# EAGLE schematic LUZES_18Fv2 (EAGLE 5.06)
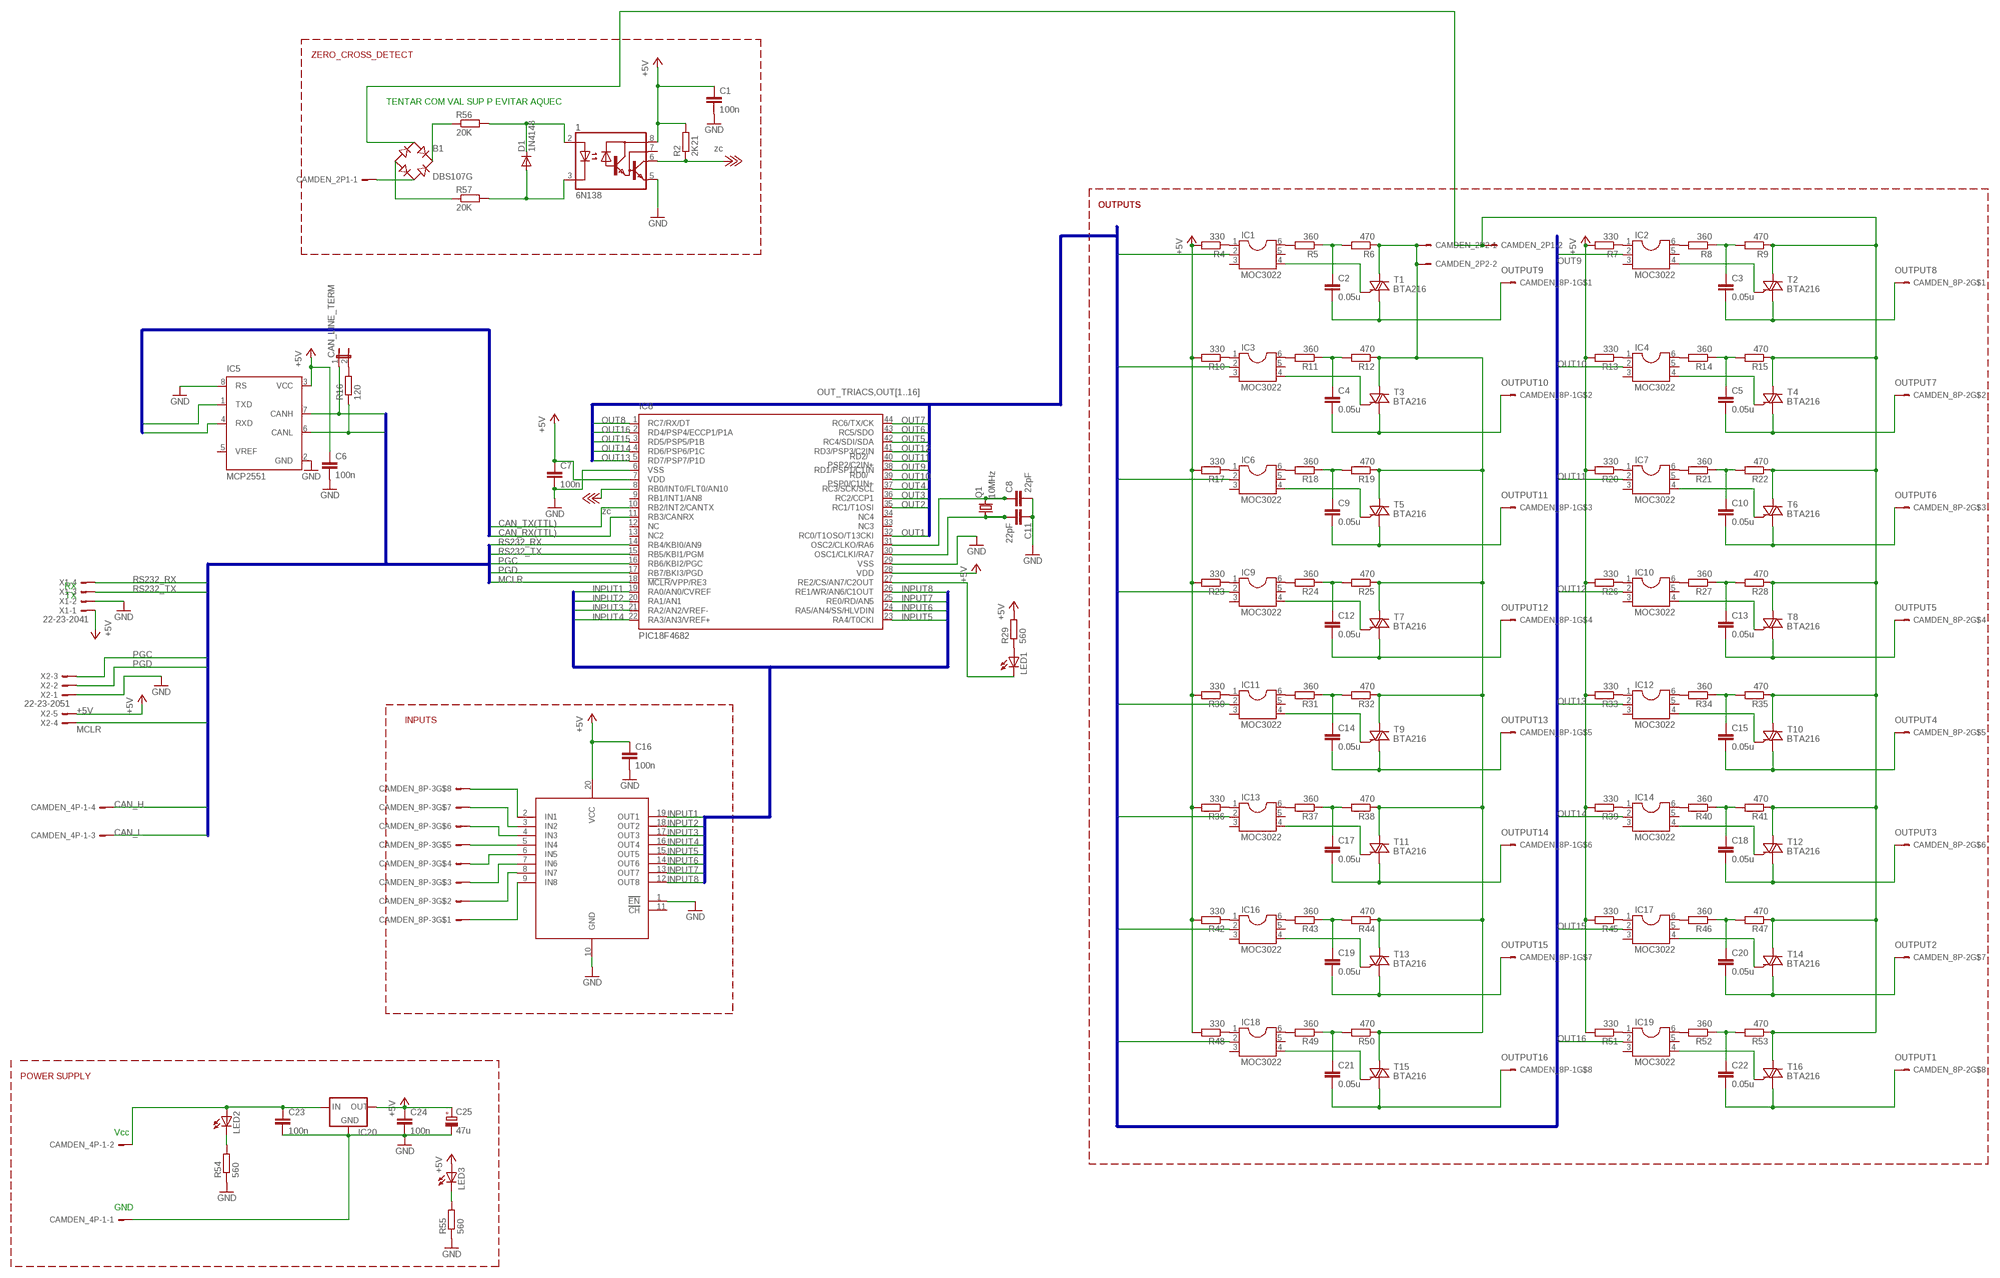
[diagram p0: schematic, sheet 1]

## Parts
1  6N138  [DIL08]
B1  DBS107G  [DBS]
C1  100n  C-EUC0805  [C0805]
C2  0.05u  C-EU050-025X075  [C050-025X075]
C3  0.05u  C-EU050-025X075  [C050-025X075]
C4  0.05u  C-EU050-025X075  [C050-025X075]
C5  0.05u  C-EU050-025X075  [C050-025X075]
C6  100n  C-EUC0805  [C0805]
C7  100n  C-EUC0805  [C0805]
C8  22pF  C-EUC0805  [C0805]
C9  0.05u  C-EU050-025X075  [C050-025X075]
C10  0.05u  C-EU050-025X075  [C050-025X075]
C11  22pF  C-EUC0805  [C0805]
C12  0.05u  C-EU050-025X075  [C050-025X075]
C13  0.05u  C-EU050-025X075  [C050-025X075]
C14  0.05u  C-EU050-025X075  [C050-025X075]
C15  0.05u  C-EU050-025X075  [C050-025X075]
C16  100n  C-EUC0805  [C0805]
C17  0.05u  C-EU050-025X075  [C050-025X075]
C18  0.05u  C-EU050-025X075  [C050-025X075]
C19  0.05u  C-EU050-025X075  [C050-025X075]
C20  0.05u  C-EU050-025X075  [C050-025X075]
C21  0.05u  C-EU050-025X075  [C050-025X075]
C22  0.05u  C-EU050-025X075  [C050-025X075]
C23  100n  C-EUC0805  [C0805]
C24  100n  C-EUC0805  [C0805]
C25  47u  CPOL-EUE2.5-5  [E2,5-5]
CAMDEN_2P1  CTB9550-2  [CTB9550-2]
CAMDEN_2P2  CTB9550-2  [CTB9550-2]
CAMDEN_4P-1  CTB9550-4  [CTB9550-4]
CAMDEN_8P-1  CTB9550-8  [CTB9550-8]
CAMDEN_8P-2  CTB9550-8  [CTB9550-8]
CAMDEN_8P-3  CTB9550-8  [CTB9550-8]
CAN_LINE_TERM  JP1E  [JP1]
D1  1N4148  [DO35-10]
IC1  MOC3022  DIL6  [DIL06]
IC2  MOC3022  DIL6  [DIL06]
IC3  MOC3022  DIL6  [DIL06]
IC4  MOC3022  DIL6  [DIL06]
IC5  MCP2551  PCA82C250  [DIL08]
IC6  MOC3022  DIL6  [DIL06]
IC7  MOC3022  DIL6  [DIL06]
IC8  PIC18F4682  PIC18F4682_85TQFP  [TQFP44]
IC9  MOC3022  DIL6  [DIL06]
IC10  MOC3022  DIL6  [DIL06]
IC11  MOC3022  DIL6  [DIL06]
IC12  MOC3022  DIL6  [DIL06]
IC13  MOC3022  DIL6  [DIL06]
IC14  MOC3022  DIL6  [DIL06]
IC15  MAX6818  MAX6818SSOP  [SSOP20]
IC16  MOC3022  DIL6  [DIL06]
IC17  MOC3022  DIL6  [DIL06]
IC18  MOC3022  DIL6  [DIL06]
IC19  MOC3022  DIL6  [DIL06]
IC20  78XXL  [78XXL]
LED1  LEDCHIP-LED0805  [CHIP-LED0805]
LED2  LEDCHIP-LED0805  [CHIP-LED0805]
LED3  LEDCHIP-LED0805  [CHIP-LED0805]
Q1  10MHz  CRYSTALHC49U-V  [HC49U-V]
R2  2K21  R-EU_M0805  [M0805]
R4  330  R-EU_M0805  [M0805]
R5  360  R-EU_R0805  [R0805]
R6  470  R-EU_R0805  [R0805]
R7  330  R-EU_M0805  [M0805]
R8  360  R-EU_R0805  [R0805]
R9  470  R-EU_R0805  [R0805]
R10  330  R-EU_M0805  [M0805]
R11  360  R-EU_R0805  [R0805]
R12  470  R-EU_R0805  [R0805]
R13  330  R-EU_M0805  [M0805]
R14  360  R-EU_R0805  [R0805]
R15  470  R-EU_R0805  [R0805]
R16  120  R-EU_M0805  [M0805]
R17  330  R-EU_M0805  [M0805]
R18  360  R-EU_R0805  [R0805]
R19  470  R-EU_R0805  [R0805]
R20  330  R-EU_M0805  [M0805]
R21  360  R-EU_R0805  [R0805]
R22  470  R-EU_R0805  [R0805]
R23  330  R-EU_M0805  [M0805]
R24  360  R-EU_R0805  [R0805]
R25  470  R-EU_R0805  [R0805]
R26  330  R-EU_M0805  [M0805]
R27  360  R-EU_R0805  [R0805]
R28  470  R-EU_R0805  [R0805]
R29  560  R-EU_R0805  [R0805]
R30  330  R-EU_M0805  [M0805]
R31  360  R-EU_R0805  [R0805]
R32  470  R-EU_R0805  [R0805]
R33  330  R-EU_M0805  [M0805]
R34  360  R-EU_R0805  [R0805]
R35  470  R-EU_R0805  [R0805]
R36  330  R-EU_M0805  [M0805]
R37  360  R-EU_R0805  [R0805]
R38  470  R-EU_R0805  [R0805]
R39  330  R-EU_M0805  [M0805]
R40  360  R-EU_R0805  [R0805]
R41  470  R-EU_R0805  [R0805]
R42  330  R-EU_M0805  [M0805]
R43  360  R-EU_R0805  [R0805]
R44  470  R-EU_R0805  [R0805]
R45  330  R-EU_M0805  [M0805]
R46  360  R-EU_R0805  [R0805]
R47  470  R-EU_R0805  [R0805]
R48  330  R-EU_M0805  [M0805]
R49  360  R-EU_R0805  [R0805]
R50  470  R-EU_R0805  [R0805]
R51  330  R-EU_M0805  [M0805]
R52  360  R-EU_R0805  [R0805]
R53  470  R-EU_R0805  [R0805]
R54  560  R-EU_R0805  [R0805]
R55  560  R-EU_R0805  [R0805]
R56  20K  R-EU_R2512  [R2512]
R57  20K  R-EU_R2512  [R2512]
T1  BTA216  TIC225S  [TO220DS]
T2  BTA216  TIC225S  [TO220DS]
T3  BTA216  TIC225S  [TO220DS]
T4  BTA216  TIC225S  [TO220DS]
T5  BTA216  TIC225S  [TO220DS]
T6  BTA216  TIC225S  [TO220DS]
T7  BTA216  TIC225S  [TO220DS]
T8  BTA216  TIC225S  [TO220DS]
T9  BTA216  TIC225S  [TO220DS]
T10  BTA216  TIC225S  [TO220DS]
T11  BTA216  TIC225S  [TO220DS]
T12  BTA216  TIC225S  [TO220DS]
T13  BTA216  TIC225S  [TO220DS]
T14  BTA216  TIC225S  [TO220DS]
T15  BTA216  TIC225S  [TO220DS]
T16  BTA216  TIC225S  [TO220DS]
X1  22-23-2041  [22-23-2041]
X2  22-23-2051  [22-23-2051]

## Nets
+5V: 1.8(VCC) C1.1 C6.1 C7.1 C16.1 C24.1 C25.+ IC5.3(VCC) IC8.7(VDD) IC8.28(VDD) IC15.20(VCC) IC20.OUT LED3.A R2.2 R4.2 R7.2 R10.2 R13.2 R17.2 R20.2 R23.2 R26.2 R29.2 R30.2 R33.2 R36.2 R39.2 R42.2 R45.2 R48.2 R51.2 X1.1 X2.5
+18V: 1.6(VO) IC8.8(RB0/INT0/FLT0/AN10) R2.1 ; supply symbol labelled zc
CAN_H: CAMDEN_4P-1.P$4 CAN_LINE_TERM.1 IC5.7(CANH)
CAN_L: CAMDEN_4P-1.P$3 IC5.6(CANL) R16.1
CAN_RX(TTL): IC5.4(RXD) IC8.11(RB3/CANRX)
CAN_TX(TTL): IC5.1(TXD) IC8.10(RB2/INT2/CANTX)
GND: 1.5(GND) C1.2 C6.2 C7.2 C8.2 C11.1 C16.2 C23.2 C24.2 C25.- CAMDEN_4P-1.P$1 IC5.2(GND) IC5.8(RS) IC8.6(VSS) IC8.29(VSS) IC15.1(EN) IC15.10(GND) IC20.GND R54.1 R55.1 X1.2 X2.1
INPUT1: IC8.19(RA0/AN0/CVREF) IC15.19(OUT1)
INPUT2: IC8.20(RA1/AN1) IC15.18(OUT2)
INPUT3: IC8.21(RA2/AN2/VREF-) IC15.17(OUT3)
INPUT4: IC8.22(RA3/AN3/VREF+) IC15.16(OUT4)
INPUT5: IC8.23(RA4/T0CKI) IC15.15(OUT5)
INPUT6: IC8.24(RA5/AN4/SS/HLVDIN) IC15.14(OUT6)
INPUT7: IC8.25(RE0/RD/AN5) IC15.13(OUT7)
INPUT8: IC8.26(RE1/WR/AN6/C1OUT) IC15.12(OUT8)
MCLR: IC8.18(!MCLR!/VPP/RE3) X2.4
N$1: C8.1 IC8.31(OSC2/CLKO/RA6) Q1.2
N$2: C11.2 IC8.30(OSC1/CLKI/RA7) Q1.1
N$3: B1.AC1 CAMDEN_2P1.P$2 R9.1 R15.1 R22.1 R28.1 R35.1 R41.1 R47.1 R53.1 T2.A2 T4.A2 T6.A2 T8.A2 T10.A2 T12.A2 T14.A2 T16.A2
N$4: B1.AC2 CAMDEN_2P1.P$1
N$5: B1.+ R56.1
N$6: CAMDEN_8P-3.P$16 IC15.2(IN1)
N$7: CAMDEN_8P-3.P$15 IC15.3(IN2)
N$8: CAMDEN_8P-3.P$9 IC15.9(IN8)
N$9: CAMDEN_8P-3.P$10 IC15.8(IN7)
N$10: CAMDEN_8P-3.P$11 IC15.7(IN6)
N$11: CAMDEN_8P-3.P$14 IC15.4(IN3)
N$12: CAMDEN_8P-3.P$13 IC15.5(IN4)
N$13: CAMDEN_8P-3.P$12 IC15.6(IN5)
N$16: IC3.6 R11.2
N$17: IC6.6 R18.2
N$18: IC9.6 R24.2
N$20: IC2.6 R8.2
N$25: IC4.6 R14.2
N$27: IC11.6 R31.2
N$29: IC13.6 R37.2
N$30: IC16.6 R43.2
N$33: IC17.6 R46.2
N$34: IC14.6 R40.2
N$35: IC12.6 R34.2
N$36: IC10.6 R27.2
N$37: IC7.6 R21.2
N$38: LED1.A R29.1
N$39: IC8.27(RE2/CS/AN7/C2OUT) LED1.C
N$40: IC18.6 R49.2
N$41: IC19.6 R52.2
N$46: CAMDEN_2P2.P$1 CAMDEN_2P2.P$2 R6.1 R12.1 R19.1 R25.1 R32.1 R38.1 R44.1 R50.1 T1.A2 T3.A2 T5.A2 T7.A2 T9.A2 T11.A2 T13.A2 T15.A2
N$111: C23.1 CAMDEN_4P-1.P$2 IC20.IN LED2.A
N$112: LED2.C R54.2
N$115: LED3.C R55.2
N$116: 1.2(A) D1.C R56.2
N$117: B1.- R57.1
N$118: 1.3(C) D1.A R57.2
N$119: IC1.1 R4.1
N$120: IC1.6 R5.2
N$121: C2.1 R5.1 R6.2
N$123: IC1.4 T1.G
N$125: IC3.1 R10.1
N$127: C4.1 R11.1 R12.2
N$129: IC3.4 T3.G
N$131: IC6.1 R17.1
N$133: C9.1 R18.1 R19.2
N$135: IC6.4 T5.G
N$137: IC9.1 R23.1
N$139: C12.1 R24.1 R25.2
N$141: IC9.4 T7.G
N$143: IC11.1 R30.1
N$145: C14.1 R31.1 R32.2
N$147: IC11.4 T9.G
N$149: IC13.1 R36.1
N$151: C17.1 R37.1 R38.2
N$153: IC13.4 T11.G
N$155: IC16.1 R42.1
N$157: C19.1 R43.1 R44.2
N$159: IC16.4 T13.G
N$161: IC18.1 R48.1
N$163: C21.1 R49.1 R50.2
N$165: IC18.4 T15.G
N$168: IC2.1 R7.1
N$170: C3.1 R8.1 R9.2
N$172: IC2.4 T2.G
N$174: IC4.1 R13.1
N$176: C5.1 R14.1 R15.2
N$178: IC4.4 T4.G
N$180: IC7.1 R20.1
N$182: C10.1 R21.1 R22.2
N$184: IC7.4 T6.G
N$186: IC10.1 R26.1
N$188: C13.1 R27.1 R28.2
N$190: IC10.4 T8.G
N$192: IC12.1 R33.1
N$194: C15.1 R34.1 R35.2
N$196: IC12.4 T10.G
N$198: IC14.1 R39.1
N$200: C18.1 R40.1 R41.2
N$202: IC14.4 T12.G
N$204: IC17.1 R45.1
N$206: C20.1 R46.1 R47.2
N$208: IC17.4 T14.G
N$210: IC19.1 R51.1
N$212: C22.1 R52.1 R53.2
N$214: IC19.4 T16.G
N$217: CAN_LINE_TERM.2 R16.2
OUT1: IC8.32(RC0/T1OSO/T13CKI) IC18.2
OUT2: IC8.35(RC1/T1OSI) IC16.2
OUT3: IC8.36(RC2/CCP1) IC13.2
OUT4: IC8.37(RC3/SCK/SCL) IC11.2
OUT5: IC8.42(RC4/SDI/SDA) IC9.2
OUT6: IC6.2 IC8.43(RC5/SDO)
OUT7: IC3.2 IC8.44(RC6/TX/CK)
OUT8: IC1.2 IC8.1(RC7/RX/DT)
OUT9: IC2.2 IC8.38(RD1/PSP1/C1IN)
OUT10: IC4.2 IC8.39(RD0/
PSP0/C1IN+)
OUT11: IC7.2 IC8.40(RD2/
PSP2/C2IN+)
OUT12: IC8.41(RD3/PSP3/C2IN) IC10.2
OUT13: IC8.5(RD7/PSP7/P1D) IC12.2
OUT14: IC8.4(RD6/PSP6/P1C) IC14.2
OUT15: IC8.3(RD5/PSP5/P1B) IC17.2
OUT16: IC8.2(RD4/PSP4/ECCP1/P1A) IC19.2
OUTPUT1: C22.2 CAMDEN_8P-2.P$16 T16.A1
OUTPUT2: C20.2 CAMDEN_8P-2.P$15 T14.A1
OUTPUT3: C18.2 CAMDEN_8P-2.P$14 T12.A1
OUTPUT4: C15.2 CAMDEN_8P-2.P$13 T10.A1
OUTPUT5: C13.2 CAMDEN_8P-2.P$12 T8.A1
OUTPUT6: C10.2 CAMDEN_8P-2.P$11 T6.A1
OUTPUT7: C5.2 CAMDEN_8P-2.P$10 T4.A1
OUTPUT8: C3.2 CAMDEN_8P-2.P$9 T2.A1
OUTPUT9: C2.2 CAMDEN_8P-1.P$9 T1.A1
OUTPUT10: C4.2 CAMDEN_8P-1.P$10 T3.A1
OUTPUT11: C9.2 CAMDEN_8P-1.P$11 T5.A1
OUTPUT12: C12.2 CAMDEN_8P-1.P$12 T7.A1
OUTPUT13: C14.2 CAMDEN_8P-1.P$13 T9.A1
OUTPUT14: C17.2 CAMDEN_8P-1.P$14 T11.A1
OUTPUT15: C19.2 CAMDEN_8P-1.P$15 T13.A1
OUTPUT16: C21.2 CAMDEN_8P-1.P$16 T15.A1
PGC: IC8.16(RB6/KBI2/PGC) X2.3
PGD: IC8.17(RB7/BKI3/PGD) X2.2
RS232_RX: IC8.14(RB4/KBI0/AN9) X1.4
RS232_TX: IC8.15(RB5/KBI1/PGM) X1.3
Unconnected: 1.7(VB) IC1.3 IC1.5 IC2.3 IC2.5 IC3.3 IC3.5 IC4.3 IC4.5 IC5.5(VREF) IC6.3 IC6.5 IC7.3 IC7.5 IC8.9(RB1/INT1/AN8) IC8.12(NC) IC8.13(NC2) IC8.33(NC3) IC8.34(NC4) IC9.3 IC9.5 IC10.3 IC10.5 IC11.3 IC11.5 IC12.3 IC12.5 IC13.3 IC13.5 IC14.3 IC14.5 IC15.11(CH) IC16.3 IC16.5 IC17.3 IC17.5 IC18.3 IC18.5 IC19.3 IC19.5

## Buses
OUT_TRIACS,OUT[1..16]
INPUTS,INPUT[1..8]
EXT_CON,+12,GND,RS232_RX,RS232_TX,CAN_L,CAN_H,MCLR,PGD,PGC
CAN_TX(TTL),CAN_RX(TTL)

## Notes on the sheet
- ZERO_CROSS_DETECT
- TENTAR COM VAL SUP P EVITAR AQUEC
- OUTPUTS | OUTPUTS
- RX
- TX
- INPUTS
- POWER SUPPLY
- Vcc
- GND

## Library data of the parts
1 = optocoupler:6N138: MOTOROLA OPTO COUPLER
B1 = rectifier:DB?*G: Single Phase 1.0 AMP Glass Passivated Bridge Rectifier Taiwan Semiconductor Co.,Ltd. - TSC Source: http://www.taiwansemi.com/TSCbig5/ezcatfiles/cust/img/img/db101g.pdf http://www.ts.com.tw/db/pictures/modules/PDT/PDT060207001/DBLS201G.pdf
C1-C24 = rcl:C-EU: CAPACITOR, European symbol
C25 = rcl:CPOL-EU: POLARIZED CAPACITOR, European symbol
CAMDEN_2P1 CAMDEN_2P2 = mycomponents:CTB9550-2
CAMDEN_4P-1 = mycomponents:CTB9550-4
CAMDEN_8P-1-CAMDEN_8P-3 = mycomponents:CTB9550-8
CAN_LINE_TERM = jumper:JP1E: JUMPER
D1 = diode:1N4148: DIODE high speed (Philips)
IC1-IC4 IC6 IC7 IC9-IC14 IC16-IC19 = ic-package:DIL6: Dual In Line
IC5 = micro-philips:PCA82C250: CAN CONTROLLER INTERFACE
IC8 = microchip:PIC18F4682_85TQFP
IC15 = maxim:MAX6818
IC20 = v-reg:78XXL: VOLTAGE REGULATOR
LED1-LED3 = led:LED: LED OSRAM: - CHIPLED LG R971, LG N971, LY N971, LG Q971, LY Q971, LO R971, LY R971 LH N974, LH R974 LS Q976, LO Q976, LY Q976 LO Q996 - Hyper CHIPLED LW Q18S LB Q993, LB Q99A, LB R99A - SideLED LS A670, LO A670, LY A670, LG A670, LP A670 LB A673, LV A673, LT A673, LW A673 LH A674 LY A675 LS A676, LA A676, LO A676, LY A676, LW A676 LS A679, LY A679, LG A679 - Hyper Micro SIDELED® LS Y876, LA Y876, LO Y876, LY Y876 LT Y87S - SmartLED LW L88C, LW L88S LB L89C, LB L89S, LG L890 LS L89K, LO L89K, LY L89K LS L896, LA L896, LO L896, LY L896 - TOPLED LS T670, LO T670, LY T670, LG T670, LP T670 LSG T670, LSP T670, LSY T670, LOP T670, LYG T670 LG T671, LOG T671, LSG T671 LB T673, LV T673, LT T673, LW T673 LH T674 LS T676, LA T676, LO T676, LY T676, LB T676, LH T676, LSB T676, LW T676 LB T67C, LV T67C, LT T67C, LS T67K, LO T67K, LY T67K, LW E67C LS E67B, LA E67B, LO E67B, LY E67B, LB E67C, LV E67C, LT E67C LW T67C LS T679, LY T679, LG T679 LS T770, LO T770, LY T770, LG T770, LP T770 LB T773, LV T773, LT T773, LW T773 LH T774 LS E675, LA E675, LY E675, LS T675 LS T776, LA T776, LO T776, LY T776, LB T776 LHGB T686 LT T68C, LB T68C - Hyper Mini TOPLED® LB M676 - Mini TOPLED Santana® LG M470 LS M47K, LO M47K, LY M47K Source: http://www.osram.convergy.de/
Q1 = crystal:CRYSTAL: CRYSTAL
R2 R4-R57 = rcl:R-EU_: RESISTOR, European symbol
T1-T16 = triac:TIC225S: TRIAC
X1 = con-molex:22-23-2041: .100" (2.54mm) Center Header - 4 Pin
X2 = con-molex:22-23-2051: .100" (2.54mm) Center Header - 5 Pin